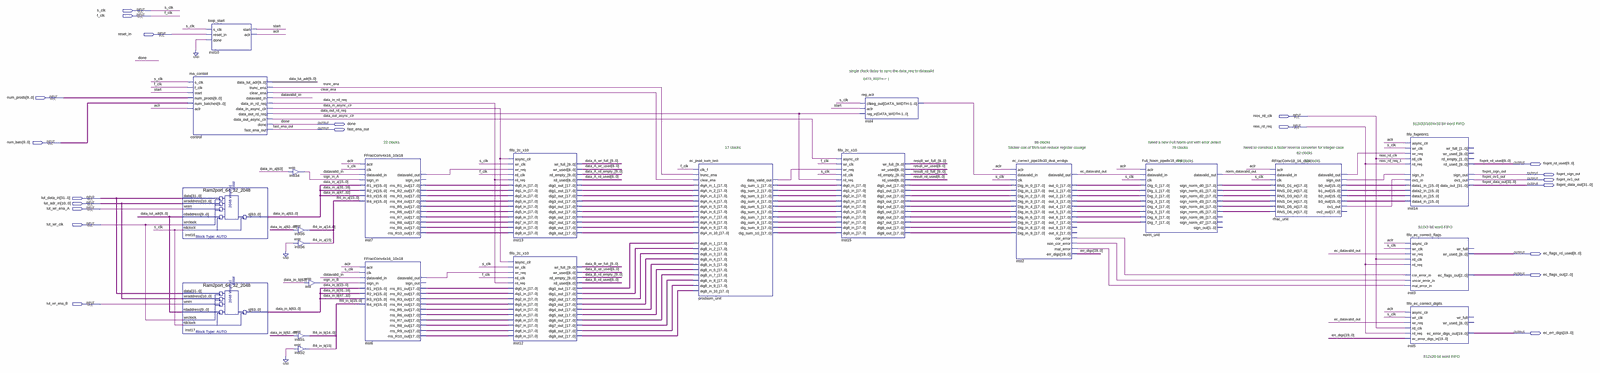
[diagram p0: schematic sheet, whole]
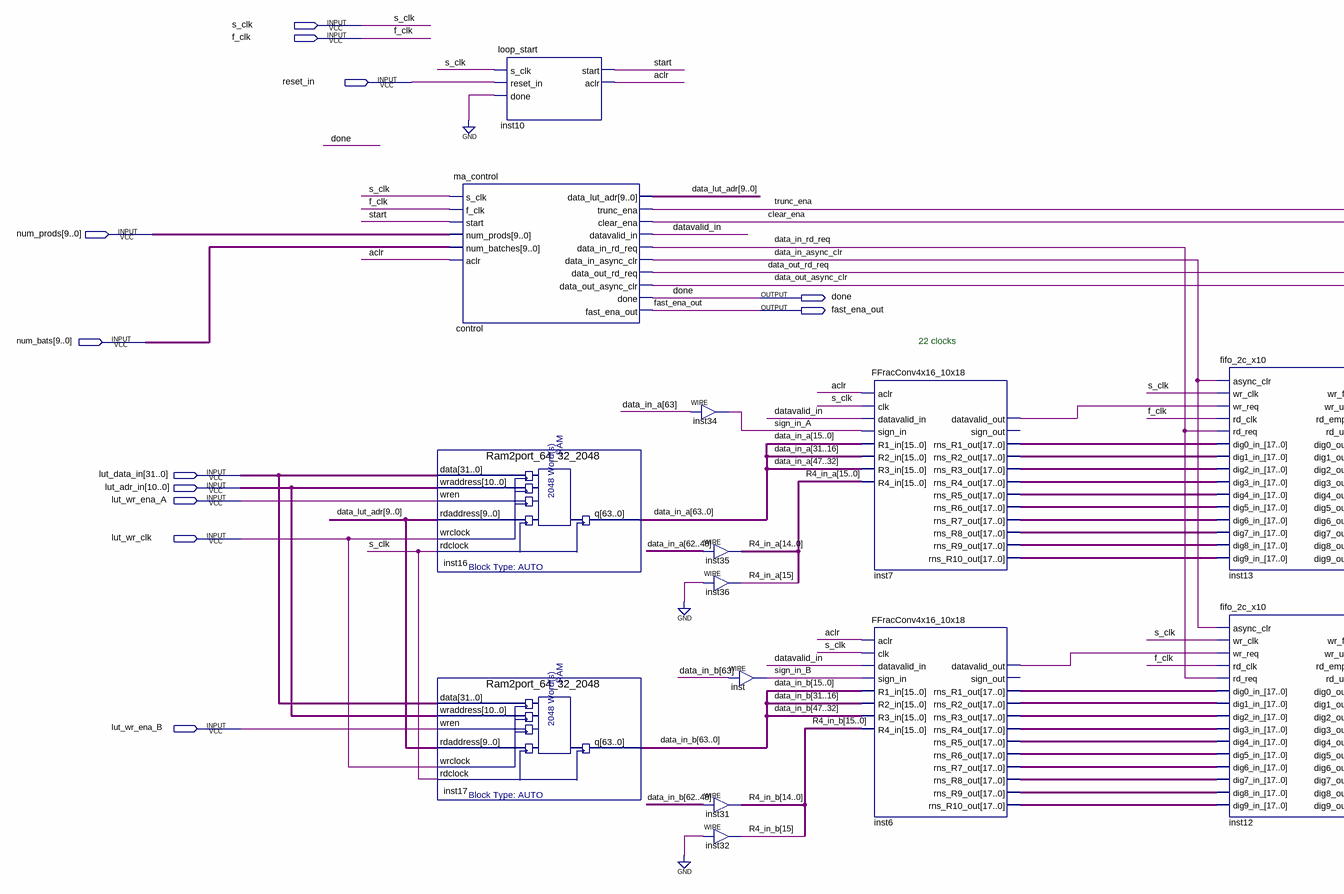
[diagram p1: schematic sheet, left part]
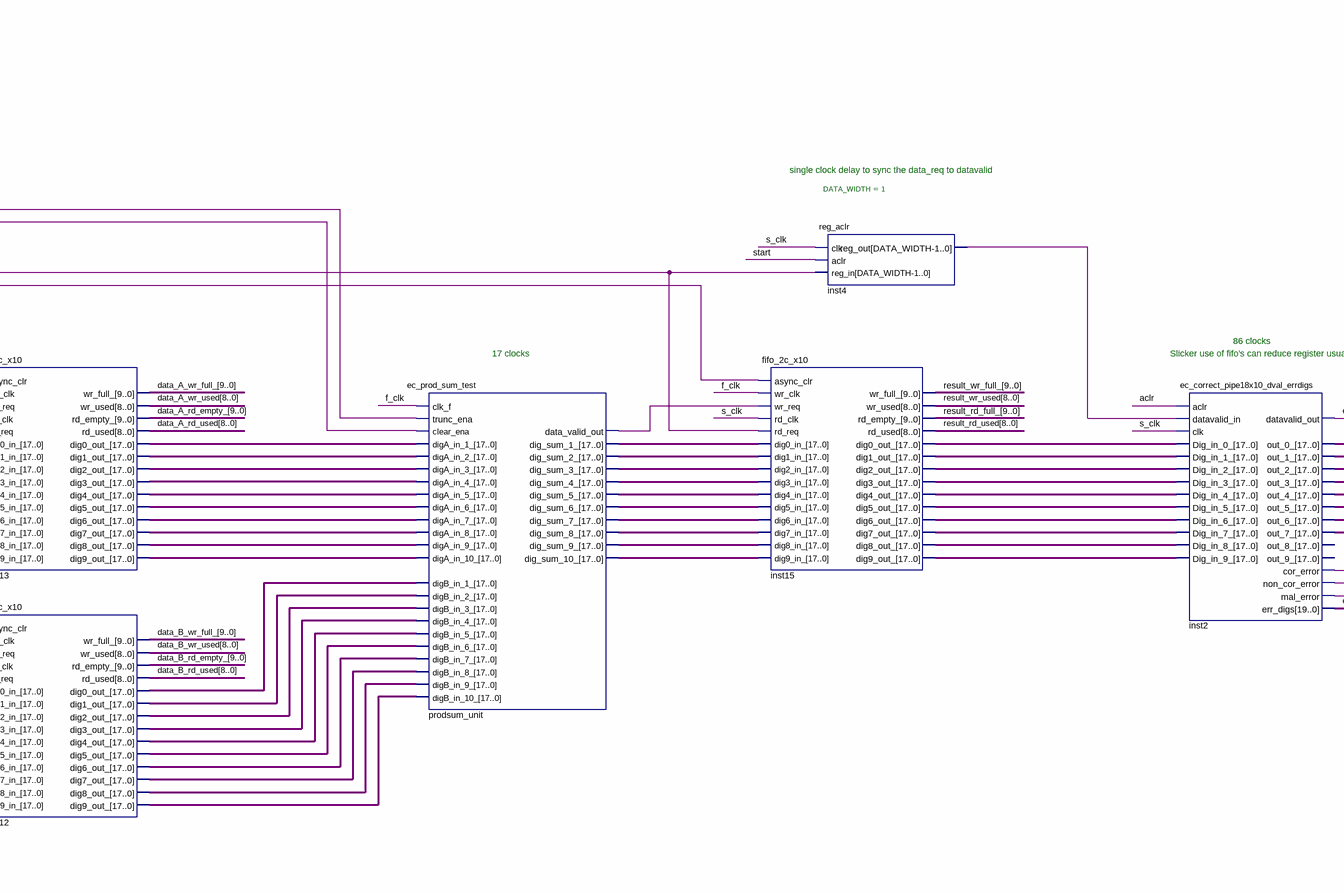
[diagram p2: schematic sheet, centre part]
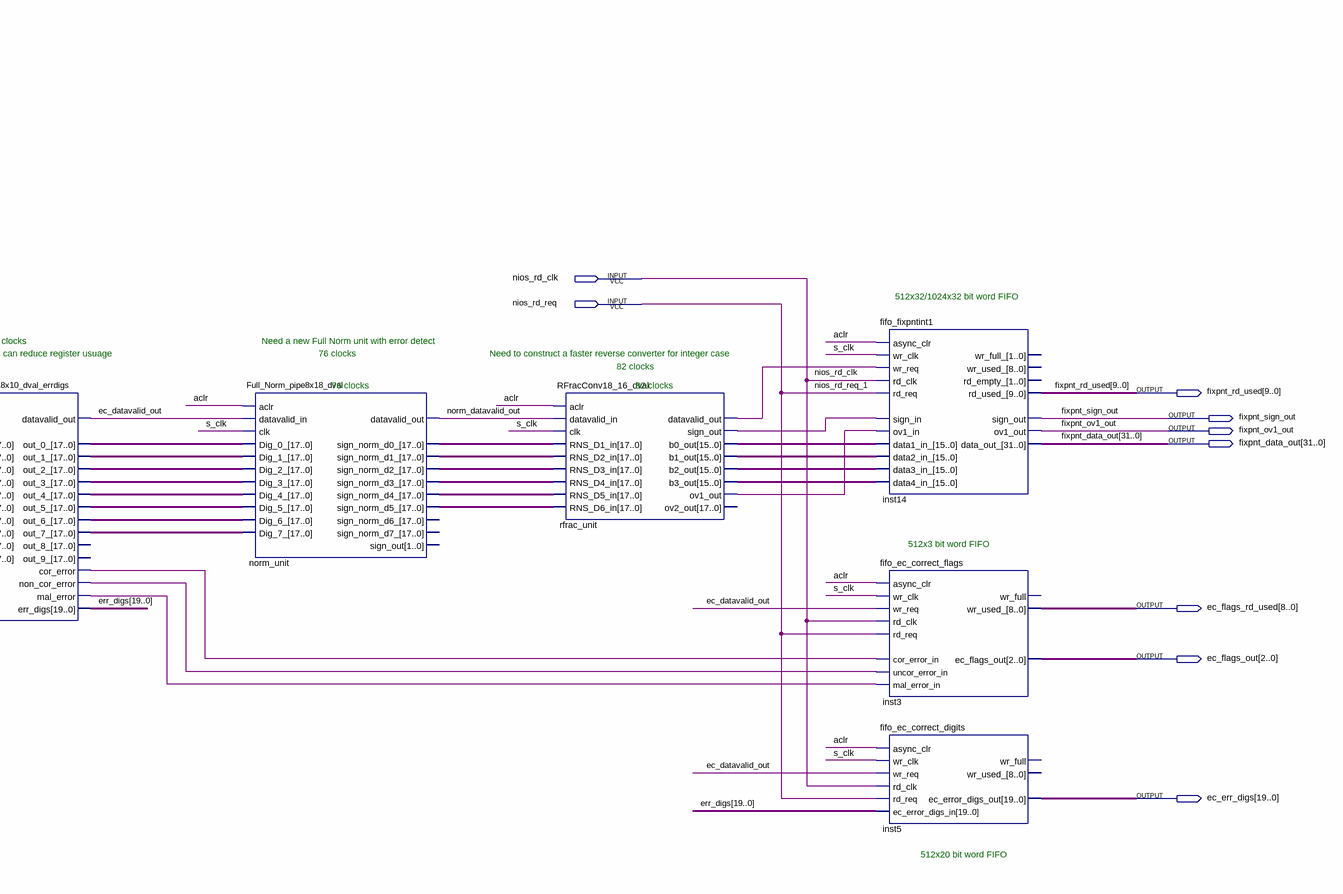
[diagram p3: schematic sheet, right part]
// Quartus schematic ec_prod_sum_test10.bdf as structural Verilog: 23 symbols, 21 pins
module ec_prod_sum_test10 (
  input  s_clk,
  input  f_clk,
  input  reset_in,
  input  [9:0] num_prods,
  input  nios_rd_clk,
  input  nios_rd_req,
  input  [9:0] num_bats,
  input  [31:0] lut_data_in,
  input  [10:0] lut_adr_in,
  input  lut_wr_ena_A,
  input  lut_wr_clk,
  input  lut_wr_ena_B,
  output done,
  output fast_ena_out,
  output [9:0] fixpnt_rd_used,
  output fixpnt_sign_out,
  output fixpnt_ov1_out,
  output [31:0] fixpnt_data_out,
  output [8:0] ec_flags_rd_used,
  output [2:0] ec_flags_out,
  output [19:0] ec_err_digs
);

  wire aclr, clear_ena, data_in_async_clr, data_in_rd_req, data_out_async_clr, data_out_rd_req, datavalid_in,
       ec_datavalid_out, inst2_cor_error, inst2_mal_error, inst2_non_cor_error, inst4_reg_out,
       inst6_datavalid_out, inst7_datavalid_out, norm_datavalid_out, prodsum_unit_data_valid_out,
       rfrac_unit_datavalid_out, rfrac_unit_ov1_out, rfrac_unit_sign_out, sign_in_A, sign_in_B, start,
       trunc_ena;
  wire [8:0] data_A_rd_used, data_A_wr_used, data_B_rd_used, data_B_wr_used, result_rd_used, result_wr_used;
  wire [9:0] data_A_rd_empty_, data_A_wr_full_, data_B_rd_empty_, data_B_wr_full_, data_lut_adr,
       result_rd_full_, result_wr_full_;
  wire [15:0] R4_in_a, R4_in_b, rfrac_unit_b0_out, rfrac_unit_b1_out, rfrac_unit_b2_out, rfrac_unit_b3_out;
  wire [17:0] inst2_out_0_, inst2_out_1_, inst2_out_2_, inst2_out_3_, inst2_out_4_, inst2_out_5_,
       inst2_out_6_, inst2_out_7_, inst6_rns_r1_out, inst6_rns_r2_out, inst6_rns_r3_out, inst6_rns_r4_out,
       inst6_rns_r5_out, inst6_rns_r6_out, inst6_rns_r7_out, inst6_rns_r8_out, inst6_rns_r9_out,
       inst6_rns_r10_out, inst7_rns_r1_out, inst7_rns_r2_out, inst7_rns_r3_out, inst7_rns_r4_out,
       inst7_rns_r5_out, inst7_rns_r6_out, inst7_rns_r7_out, inst7_rns_r8_out, inst7_rns_r9_out,
       inst7_rns_r10_out, inst12_dig0_out_, inst12_dig1_out_, inst12_dig2_out_, inst12_dig3_out_,
       inst12_dig4_out_, inst12_dig5_out_, inst12_dig6_out_, inst12_dig7_out_, inst12_dig8_out_,
       inst12_dig9_out_, inst13_dig0_out_, inst13_dig1_out_, inst13_dig2_out_, inst13_dig3_out_,
       inst13_dig4_out_, inst13_dig5_out_, inst13_dig6_out_, inst13_dig7_out_, inst13_dig8_out_,
       inst13_dig9_out_, inst15_dig0_out_, inst15_dig1_out_, inst15_dig2_out_, inst15_dig3_out_,
       inst15_dig4_out_, inst15_dig5_out_, inst15_dig6_out_, inst15_dig7_out_, inst15_dig8_out_,
       inst15_dig9_out_, norm_unit_sign_norm_d0_, norm_unit_sign_norm_d1_, norm_unit_sign_norm_d2_,
       norm_unit_sign_norm_d3_, norm_unit_sign_norm_d4_, norm_unit_sign_norm_d5_, prodsum_unit_dig_sum_1_,
       prodsum_unit_dig_sum_2_, prodsum_unit_dig_sum_3_, prodsum_unit_dig_sum_4_, prodsum_unit_dig_sum_5_,
       prodsum_unit_dig_sum_6_, prodsum_unit_dig_sum_7_, prodsum_unit_dig_sum_8_, prodsum_unit_dig_sum_9_,
       prodsum_unit_dig_sum_10_;
  wire [19:0] err_digs;
  wire [63:0] data_in_a, data_in_b;

  ma_control control (
    .s_clk(s_clk), .f_clk(f_clk), .start(start), .num_prods(num_prods), .num_batches(num_bats), .aclr(aclr),
    .data_lut_adr(data_lut_adr), .trunc_ena(trunc_ena), .clear_ena(clear_ena), .datavalid_in(datavalid_in),
    .data_in_rd_req(data_in_rd_req), .data_in_async_clr(data_in_async_clr),
    .data_out_rd_req(data_out_rd_req), .data_out_async_clr(data_out_async_clr), .fast_ena_out(fast_ena_out),
    .done(done));
  Ram2port_64_32_2048 inst16 (
    .data(lut_data_in), .wraddress(lut_adr_in), .wren(lut_wr_ena_A), .rdaddress(data_lut_adr),
    .wrclock(lut_wr_clk), .rdclock(s_clk), .q(data_in_a));
  Ram2port_64_32_2048 inst17 (
    .data(lut_data_in), .wraddress(lut_adr_in), .wren(lut_wr_ena_B), .rdaddress(data_lut_adr),
    .wrclock(lut_wr_clk), .rdclock(s_clk), .q(data_in_b));
  loop_start inst10 (.s_clk(s_clk), .reset_in(reset_in), .done(1'b0), .start(start), .aclr(aclr));
  assign sign_in_A = data_in_a[63];  // WIRE inst34
  assign R4_in_a[14:0] = data_in_a[62:48];  // WIRE inst35
  assign R4_in_a[15] = 1'b0;  // WIRE inst36
  assign sign_in_B = data_in_b[63];  // WIRE inst
  assign R4_in_b[14:0] = data_in_b[62:48];  // WIRE inst31
  assign R4_in_b[15] = 1'b0;  // WIRE inst32
  FFracConv4x16_10x18 inst7 (
    .clk(s_clk), .sign_in(sign_in_A), .datavalid_in(datavalid_in), .aclr(aclr), .R1_in(data_in_a[15:0]),
    .R2_in(data_in_a[31:16]), .R3_in(data_in_a[47:32]), .R4_in(R4_in_a), .datavalid_out(inst7_datavalid_out),
    .rns_R10_out(inst7_rns_r10_out), .rns_R1_out(inst7_rns_r1_out), .rns_R2_out(inst7_rns_r2_out),
    .rns_R3_out(inst7_rns_r3_out), .rns_R4_out(inst7_rns_r4_out), .rns_R5_out(inst7_rns_r5_out),
    .rns_R6_out(inst7_rns_r6_out), .rns_R7_out(inst7_rns_r7_out), .rns_R8_out(inst7_rns_r8_out),
    .rns_R9_out(inst7_rns_r9_out));  // open: sign_out
  FFracConv4x16_10x18 inst6 (
    .clk(s_clk), .sign_in(sign_in_B), .datavalid_in(datavalid_in), .aclr(aclr), .R1_in(data_in_b[15:0]),
    .R2_in(data_in_b[31:16]), .R3_in(data_in_b[47:32]), .R4_in(R4_in_b), .datavalid_out(inst6_datavalid_out),
    .rns_R10_out(inst6_rns_r10_out), .rns_R1_out(inst6_rns_r1_out), .rns_R2_out(inst6_rns_r2_out),
    .rns_R3_out(inst6_rns_r3_out), .rns_R4_out(inst6_rns_r4_out), .rns_R5_out(inst6_rns_r5_out),
    .rns_R6_out(inst6_rns_r6_out), .rns_R7_out(inst6_rns_r7_out), .rns_R8_out(inst6_rns_r8_out),
    .rns_R9_out(inst6_rns_r9_out));  // open: sign_out
  fifo_2c_x10 inst13 (
    .wr_clk(s_clk), .rd_clk(f_clk), .wr_req(inst7_datavalid_out), .rd_req(data_in_rd_req),
    .async_clr(data_in_async_clr), .dig0_in_(inst7_rns_r1_out), .dig1_in_(inst7_rns_r2_out),
    .dig2_in_(inst7_rns_r3_out), .dig3_in_(inst7_rns_r4_out), .dig4_in_(inst7_rns_r5_out),
    .dig5_in_(inst7_rns_r6_out), .dig6_in_(inst7_rns_r7_out), .dig7_in_(inst7_rns_r8_out),
    .dig8_in_(inst7_rns_r9_out), .dig9_in_(inst7_rns_r10_out), .dig0_out_(inst13_dig0_out_),
    .dig1_out_(inst13_dig1_out_), .dig2_out_(inst13_dig2_out_), .dig3_out_(inst13_dig3_out_),
    .dig4_out_(inst13_dig4_out_), .dig5_out_(inst13_dig5_out_), .dig6_out_(inst13_dig6_out_),
    .dig7_out_(inst13_dig7_out_), .dig8_out_(inst13_dig8_out_), .dig9_out_(inst13_dig9_out_),
    .rd_empty_(data_A_rd_empty_), .rd_used(data_A_rd_used), .wr_full_(data_A_wr_full_),
    .wr_used(data_A_wr_used));
  fifo_2c_x10 inst12 (
    .wr_clk(s_clk), .rd_clk(f_clk), .wr_req(inst6_datavalid_out), .rd_req(data_in_rd_req),
    .async_clr(data_in_async_clr), .dig0_in_(inst6_rns_r1_out), .dig1_in_(inst6_rns_r2_out),
    .dig2_in_(inst6_rns_r3_out), .dig3_in_(inst6_rns_r4_out), .dig4_in_(inst6_rns_r5_out),
    .dig5_in_(inst6_rns_r6_out), .dig6_in_(inst6_rns_r7_out), .dig7_in_(inst6_rns_r8_out),
    .dig8_in_(inst6_rns_r9_out), .dig9_in_(inst6_rns_r10_out), .dig0_out_(inst12_dig0_out_),
    .dig1_out_(inst12_dig1_out_), .dig2_out_(inst12_dig2_out_), .dig3_out_(inst12_dig3_out_),
    .dig4_out_(inst12_dig4_out_), .dig5_out_(inst12_dig5_out_), .dig6_out_(inst12_dig6_out_),
    .dig7_out_(inst12_dig7_out_), .dig8_out_(inst12_dig8_out_), .dig9_out_(inst12_dig9_out_),
    .rd_empty_(data_B_rd_empty_), .rd_used(data_B_rd_used), .wr_full_(data_B_wr_full_),
    .wr_used(data_B_wr_used));
  ec_prod_sum_test prodsum_unit (
    .clk_f(f_clk), .trunc_ena(trunc_ena), .clear_ena(clear_ena), .digA_in_10_(inst13_dig9_out_),
    .digA_in_1_(inst13_dig0_out_), .digA_in_2_(inst13_dig1_out_), .digA_in_3_(inst13_dig2_out_),
    .digA_in_4_(inst13_dig3_out_), .digA_in_5_(inst13_dig4_out_), .digA_in_6_(inst13_dig5_out_),
    .digA_in_7_(inst13_dig6_out_), .digA_in_8_(inst13_dig7_out_), .digA_in_9_(inst13_dig8_out_),
    .digB_in_10_(inst12_dig9_out_), .digB_in_1_(inst12_dig0_out_), .digB_in_2_(inst12_dig1_out_),
    .digB_in_3_(inst12_dig2_out_), .digB_in_4_(inst12_dig3_out_), .digB_in_5_(inst12_dig4_out_),
    .digB_in_6_(inst12_dig5_out_), .digB_in_7_(inst12_dig6_out_), .digB_in_8_(inst12_dig7_out_),
    .digB_in_9_(inst12_dig8_out_), .data_valid_out(prodsum_unit_data_valid_out),
    .dig_sum_10_(prodsum_unit_dig_sum_10_), .dig_sum_1_(prodsum_unit_dig_sum_1_),
    .dig_sum_2_(prodsum_unit_dig_sum_2_), .dig_sum_3_(prodsum_unit_dig_sum_3_),
    .dig_sum_4_(prodsum_unit_dig_sum_4_), .dig_sum_5_(prodsum_unit_dig_sum_5_),
    .dig_sum_6_(prodsum_unit_dig_sum_6_), .dig_sum_7_(prodsum_unit_dig_sum_7_),
    .dig_sum_8_(prodsum_unit_dig_sum_8_), .dig_sum_9_(prodsum_unit_dig_sum_9_));
  fifo_2c_x10 inst15 (
    .wr_clk(f_clk), .rd_clk(s_clk), .wr_req(prodsum_unit_data_valid_out), .rd_req(data_out_rd_req),
    .async_clr(data_out_async_clr), .dig0_in_(prodsum_unit_dig_sum_1_), .dig1_in_(prodsum_unit_dig_sum_2_),
    .dig2_in_(prodsum_unit_dig_sum_3_), .dig3_in_(prodsum_unit_dig_sum_4_),
    .dig4_in_(prodsum_unit_dig_sum_5_), .dig5_in_(prodsum_unit_dig_sum_6_),
    .dig6_in_(prodsum_unit_dig_sum_7_), .dig7_in_(prodsum_unit_dig_sum_8_),
    .dig8_in_(prodsum_unit_dig_sum_9_), .dig9_in_(prodsum_unit_dig_sum_10_), .dig0_out_(inst15_dig0_out_),
    .dig1_out_(inst15_dig1_out_), .dig2_out_(inst15_dig2_out_), .dig3_out_(inst15_dig3_out_),
    .dig4_out_(inst15_dig4_out_), .dig5_out_(inst15_dig5_out_), .dig6_out_(inst15_dig6_out_),
    .dig7_out_(inst15_dig7_out_), .dig8_out_(inst15_dig8_out_), .dig9_out_(inst15_dig9_out_),
    .rd_empty_(result_rd_full_), .rd_used(result_rd_used), .wr_full_(result_wr_full_),
    .wr_used(result_wr_used));
  reg_aclr #(.DATA_WIDTH(1)) inst4 (.clk(s_clk), .aclr(start), .reg_in(data_out_rd_req), .reg_out(inst4_reg_out));
  ec_correct_pipe18x10_dval_errdigs inst2 (
    .clk(s_clk), .datavalid_in(inst4_reg_out), .aclr(aclr), .Dig_in_0_(inst15_dig0_out_),
    .Dig_in_1_(inst15_dig1_out_), .Dig_in_2_(inst15_dig2_out_), .Dig_in_3_(inst15_dig3_out_),
    .Dig_in_4_(inst15_dig4_out_), .Dig_in_5_(inst15_dig5_out_), .Dig_in_6_(inst15_dig6_out_),
    .Dig_in_7_(inst15_dig7_out_), .Dig_in_8_(inst15_dig8_out_), .Dig_in_9_(inst15_dig9_out_),
    .cor_error(inst2_cor_error), .non_cor_error(inst2_non_cor_error), .mal_error(inst2_mal_error),
    .datavalid_out(ec_datavalid_out), .err_digs(err_digs), .out_0_(inst2_out_0_), .out_1_(inst2_out_1_),
    .out_2_(inst2_out_2_), .out_3_(inst2_out_3_), .out_4_(inst2_out_4_), .out_5_(inst2_out_5_),
    .out_6_(inst2_out_6_), .out_7_(inst2_out_7_));  // open: out_8_, out_9_
  Full_Norm_pipe8x18_dval norm_unit (
    .clk(s_clk), .aclr(aclr), .datavalid_in(ec_datavalid_out), .Dig_0_(inst2_out_0_), .Dig_1_(inst2_out_1_),
    .Dig_2_(inst2_out_2_), .Dig_3_(inst2_out_3_), .Dig_4_(inst2_out_4_), .Dig_5_(inst2_out_5_),
    .Dig_6_(inst2_out_6_), .Dig_7_(inst2_out_7_), .datavalid_out(norm_datavalid_out),
    .sign_norm_d0_(norm_unit_sign_norm_d0_), .sign_norm_d1_(norm_unit_sign_norm_d1_),
    .sign_norm_d2_(norm_unit_sign_norm_d2_), .sign_norm_d3_(norm_unit_sign_norm_d3_),
    .sign_norm_d4_(norm_unit_sign_norm_d4_), .sign_norm_d5_(norm_unit_sign_norm_d5_));  // open: sign_norm_d6_, sign_norm_d7_, sign_out
  RFracConv18_16_dval rfrac_unit (
    .clk(s_clk), .aclr(aclr), .datavalid_in(norm_datavalid_out), .RNS_D1_in(norm_unit_sign_norm_d0_),
    .RNS_D2_in(norm_unit_sign_norm_d1_), .RNS_D3_in(norm_unit_sign_norm_d2_),
    .RNS_D4_in(norm_unit_sign_norm_d3_), .RNS_D5_in(norm_unit_sign_norm_d4_),
    .RNS_D6_in(norm_unit_sign_norm_d5_), .ov1_out(rfrac_unit_ov1_out), .sign_out(rfrac_unit_sign_out),
    .datavalid_out(rfrac_unit_datavalid_out), .b0_out(rfrac_unit_b0_out), .b1_out(rfrac_unit_b1_out),
    .b2_out(rfrac_unit_b2_out), .b3_out(rfrac_unit_b3_out));  // open: ov2_out
  fifo_fixpntint1 inst14 (
    .wr_clk(s_clk), .rd_clk(nios_rd_clk), .wr_req(rfrac_unit_datavalid_out), .rd_req(nios_rd_req),
    .async_clr(aclr), .sign_in(rfrac_unit_sign_out), .ov1_in(rfrac_unit_ov1_out),
    .data1_in_(rfrac_unit_b0_out), .data2_in_(rfrac_unit_b1_out), .data3_in_(rfrac_unit_b2_out),
    .data4_in_(rfrac_unit_b3_out), .sign_out(fixpnt_sign_out), .ov1_out(fixpnt_ov1_out),
    .data_out_(fixpnt_data_out), .rd_used_(fixpnt_rd_used));  // open: rd_empty_, wr_full_, wr_used_
  fifo_ec_correct_flags inst3 (
    .wr_clk(s_clk), .rd_clk(nios_rd_clk), .wr_req(ec_datavalid_out), .rd_req(nios_rd_req), .async_clr(aclr),
    .cor_error_in(inst2_cor_error), .uncor_error_in(inst2_non_cor_error), .mal_error_in(inst2_mal_error),
    .ec_flags_out(ec_flags_out), .wr_used_(ec_flags_rd_used));  // open: wr_full
  fifo_ec_correct_digits inst5 (
    .wr_clk(s_clk), .rd_clk(nios_rd_clk), .wr_req(ec_datavalid_out), .rd_req(nios_rd_req), .async_clr(aclr),
    .ec_error_digs_in(err_digs), .ec_error_digs_out(ec_err_digs));  // open: wr_full, wr_used_

  // Other names for the same wires on the sheet: nios_rd_req_1 = nios_rd_req

  // Notes on the sheet:
  //   single clock delay to sync the data_req to datavalid
  //   512x32/1024x32 bit word FIFO
  //   22 clocks
  //   86 clocks
  //   Need a new Full Norm unit with error detect
  //   17 clocks
  //   Slicker use of fifo's can reduce register usuage
  //   76 clocks
  //   Need to construct a faster reverse converter for integer case
  //   82 clocks
  //   76 clocks
  //   82 clocks
  //   512x3 bit word FIFO
  //   512x20 bit word FIFO
endmodule
